# Altium schematic sheet SW6121+A+A+B+LED.SchDoc
size A3; SheetNumber: 0; SheetTotal: 0
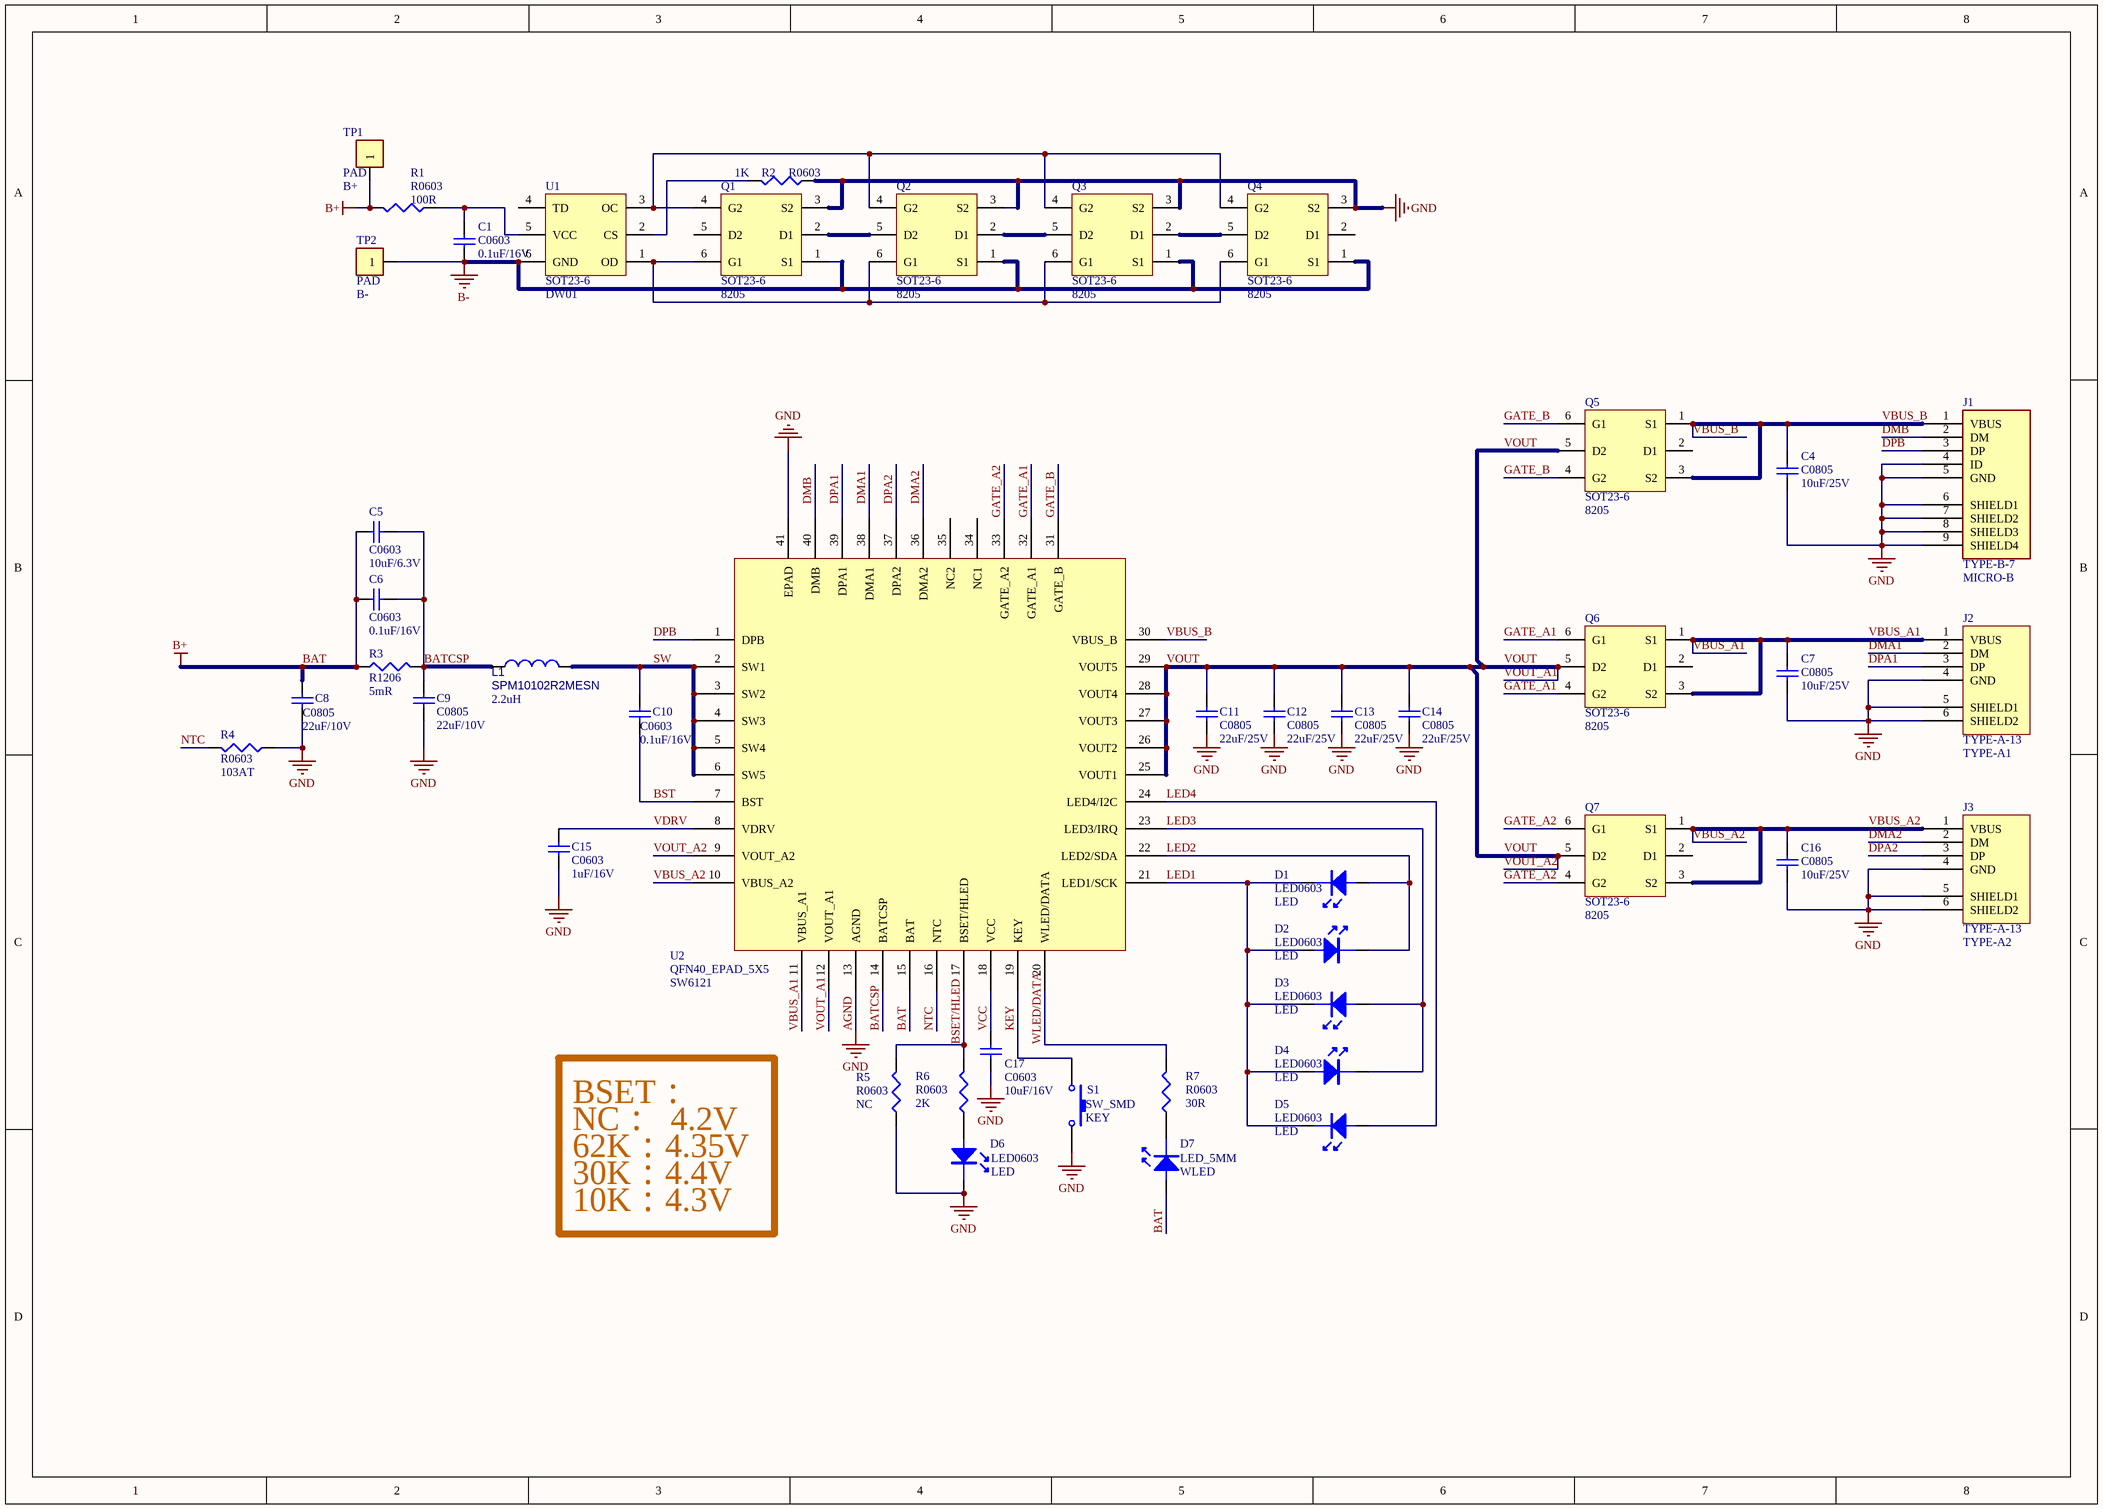
[diagram p0: SW6121+A+A+B+LED.SchDoc]

## Parts
C1  C0603  value 0.1uF/16V  [C0603]
C4  C0805  value 10uF/25V  [C0805]
C5  C0603  value 10uF/6.3V  [C0603]
C6  C0603  value 0.1uF/16V  [C0603]
C7  C0805  value 10uF/25V  [C0805]
C8  C0805  value 22uF/10V  [C0805]
C9  C0805  value 22uF/10V  [C0805]
C10  C0603  value 0.1uF/16V  [C0603]
C11  C0805  value 22uF/25V  [C0805]
C12  C0805  value 22uF/25V  [C0805]
C13  C0805  value 22uF/25V  [C0805]
C14  C0805  value 22uF/25V  [C0805]
C15  C0603  value 1uF/16V  [C0603]
C16  C0805  value 10uF/25V  [C0805]
C17  C0603  value 10uF/16V  [C0603]
D1  LED  [LED0603]
D2  LED  [LED0603]
D3  LED  [LED0603]
D4  LED  [LED0603]
D5  LED  [LED0603]
D6  LED  [LED0603]
D7  value WLED  [LED_5MM]  (hidden comment: LED_5MM)
J1  value MICRO-B  [TYPE-B-7]  (hidden comment: USB_MICRO_B)
J2  value TYPE-A1  [TYPE-A-13]  (hidden comment: TYPE-A-1)
J3  value TYPE-A2  [TYPE-A-13]  (hidden comment: TYPE-A-1)
L1  SPM10102R2MESN  value 2.2uH  [INDUCTOR_SPM1010]
Q1  8205  [SOT23-6]
Q2  8205  [SOT23-6]
Q3  8205  [SOT23-6]
Q4  8205  [SOT23-6]
Q5  8205  [SOT23-6]
Q6  8205  [SOT23-6]
Q7  8205  [SOT23-6]
R1  R0603  value 100R  [R0603]
R2  R0603  value 1K  [R0603]
R3  R1206  value 5mR  [R1206]
R4  R0603  value 103AT  [R0603]
R5  R0603  value NC  [R0603]
R6  R0603  value 2K  [R0603]
R7  R0603  value 30R  [R0603]
S1  KEY  [SW_SMD]
TP1  B+  [PAD]
TP2  B-  [PAD]
U1  DW01  [SOT23-6]
U2  Footprint: QFN40_EPAD_5X5  (hidden comment: SW6121)

## Nets
AGND: C4.1 C7.1 C8.1 C9.1 C11.1 C12.1 C13.1 C14.1 C15.1 C16.1 C17.1 D6.2(K) J1.4(ID) J1.5(GND) J1.6(SHIELD1) J1.7(SHIELD2) J1.8(SHIELD3) J1.9(SHIELD4) J2.4(GND) J2.5(SHIELD1) J2.6(SHIELD2) J3.4(GND) J3.5(SHIELD1) J3.6(SHIELD2) Q1.3(S2) Q2.3(S2) Q3.3(S2) Q4.3(S2) R2.1 R4.1 R5.1 S1.2 U2.13(AGND) U2.41(EPAD)  [also labelled GND]
B-: C1.1 Q1.1(S1) Q2.1(S1) Q3.1(S1) Q4.1(S1) TP2.1 U1.6(GND)
BAT: C5.1 C6.1 C8.2 D7.1(A) R1.2 R3.1 TP1.1 U2.15(BAT)  [also labelled B+]
BATCSP: C5.2 C6.2 C9.2 L1.1 R3.2 U2.14(BATCSP)
BSET/HLED: R5.2 R6.2 U2.17(BSET/HLED)
BST: C10.1 U2.7(BST)
DMA1: J2.2(DM) U2.38(DMA1)
DMA2: J3.2(DM) U2.36(DMA2)
DMB: J1.2(DM) U2.40(DMB)
DPA1: J2.3(DP) U2.39(DPA1)
DPA2: J3.3(DP) U2.37(DPA2)
DPB: J1.3(DP) U2.1(DPB)
GATE_A1: Q6.4(G2) Q6.6(G1) U2.32(GATE_A1)
GATE_A2: Q7.4(G2) Q7.6(G1) U2.33(GATE_A2)
GATE_B: Q5.4(G2) Q5.6(G1) U2.31(GATE_B)
KEY: S1.1 U2.19(KEY)
LED1: D1.2(K) D2.1(A) D3.2(K) D4.1(A) D5.2(K) U2.21(LED1/SCK)
LED2: D1.1(A) D2.2(K) U2.22(LED2/SDA)
LED3: D3.1(A) D4.2(K) U2.23(LED3/IRQ)
LED4: D5.1(A) U2.24(LED4/I2C)
NTC: R4.2 U2.16(NTC)
SW: C10.2 L1.2 U2.2(SW1) U2.3(SW2) U2.4(SW3) U2.5(SW4) U2.6(SW5)
VBUS_A1: C7.2 J2.1(VBUS) Q6.1(S1) Q6.3(S2) U2.11(VBUS_A1)
VBUS_A2: C16.2 J3.1(VBUS) Q7.1(S1) Q7.3(S2) U2.10(VBUS_A2)
VBUS_B: C4.2 J1.1(VBUS) Q5.1(S1) Q5.3(S2) U2.30(VBUS_B)
VCC: C17.2 U2.18(VCC)
VDRV: C15.2 U2.8(VDRV)
VOUT: C11.2 C12.2 C13.2 C14.2 Q5.5(D2) Q6.5(D2) Q7.5(D2) U2.9(VOUT_A2) U2.12(VOUT_A1) U2.25(VOUT1) U2.26(VOUT2) U2.27(VOUT3) U2.28(VOUT4) U2.29(VOUT5)  [also labelled VOUT_A1, VOUT_A2]
WLED/DATA: R7.2 U2.20(WLED/DATA)
NetC1_2: C1.2 R1.1 U1.5(VCC)
NetD6_1: D6.1(A) R6.1
NetD7_2: D7.2(K) R7.1
NetQ1_2: Q1.2(D1) Q2.5(D2)
NetQ1_4: Q1.4(G2) Q2.4(G2) Q3.4(G2) Q4.4(G2) U1.3(OC)
NetQ1_6: Q1.6(G1) Q2.6(G1) Q3.6(G1) Q4.6(G1) U1.1(OD)
NetQ2_2: Q2.2(D1) Q3.5(D2)
NetQ3_2: Q3.2(D1) Q4.5(D2)
NetR2_2: R2.2 U1.2(CS)

Not connected (* = marked no-connect by the designer): Q1 5(D2); Q4 2(D1); Q5 2(D1); Q6 2(D1); Q7 2(D1); U1 4(TD); U2 34(NC1) 35(NC2)

## Notes on the sheet
- BSET：
- NC：  4.2V
- 62K：4.35V
- 30K：4.4V
- 10K：4.3V

## Library data of the parts
C1 = Cap: Capacitor; Published: 8-Jun-2000; LatestRevisionDate: 17-Jul-2002; LatestRevisionNote: Re-released for DXP Platform.; PackageReference: RAD-0.3; Publisher: Altium Limited; PackageDescription: Radial Cap, Thru-Hole; 2 Leads; 0.3 in Pin Spacing
C4-C7 C10 C15-C17 = CAP0603: Capacitor; Published: 8-Jun-2000; LatestRevisionDate: 17-Jul-2002; LatestRevisionNote: Re-released for DXP Platform.; PackageReference: RAD-0.3; Publisher: Altium Limited; PackageDescription: Radial Cap, Thru-Hole; 2 Leads; 0.3 in Pin Spacing
C8 C9 C11-C14 = CAP0805: Capacitor; Published: 8-Jun-2000; LatestRevisionDate: 17-Jul-2002; LatestRevisionNote: Re-released for DXP Platform.; PackageReference: RAD-0.3; Publisher: Altium Limited; PackageDescription: Radial Cap, Thru-Hole; 2 Leads; 0.3 in Pin Spacing
D1-D6 = LED: 单?: 0.1; Value: LED
D7 = LED: Footprinf: LED_5MM
L1 = INDUCTOR
Q1-Q7 = 8205B: Value: 8205; Footprinf: SOT23-6
R1 R2 = Res3: Resistor; Published: 8-Jun-2000; LatestRevisionDate: 29-May-2009; LatestRevisionNote: IPC-7351 Footprint Added.; PackageReference: J1-0603; Publisher: Altium Limited; PackageDescription: Chip Resistor
R3-R7 = RES: Resistor; Published: 8-Jun-2000; LatestRevisionDate: 29-May-2009; LatestRevisionNote: IPC-7351 Footprint Added.; PackageReference: J1-0603; Publisher: Altium Limited; PackageDescription: Chip Resistor
S1 = SW K: Value: KEY; Footprinf: SW_SMD
TP1 TP2 = Test Point
  TP1: Value: B+
  TP2: Value: B-
U2 = SW6106_AFC: Value: SW6121
J1 = USB_MICRO_B: Footprintf: TYPE-B-7
J2 J3 = TYPE-A-1: Footprinf: TYPE-A-13
U1 = DW01: Value: DW01; Footprinf: SOT23-6